# Altium schematic sheet SuperFin Baseboard pg7.SchDoc
size B; PageSetup: Record=PageOptions|CenterHorizontal=True|CenterVertical=True|PrintScale=1.09|XCorrection=1.00|YCorrection=1.00|PrintKind=0|BorderSize=5000000|LeftOffset=0|BottomOffset=0|Orientation=2|PaperLength=1000|PaperWidth=1000|Scale=100|PaperSource=7|PrintQuality=-4|MediaType=1|DitherType=10|PaperKind=Tabloid 11 x 17in|PrintScaleMode=1
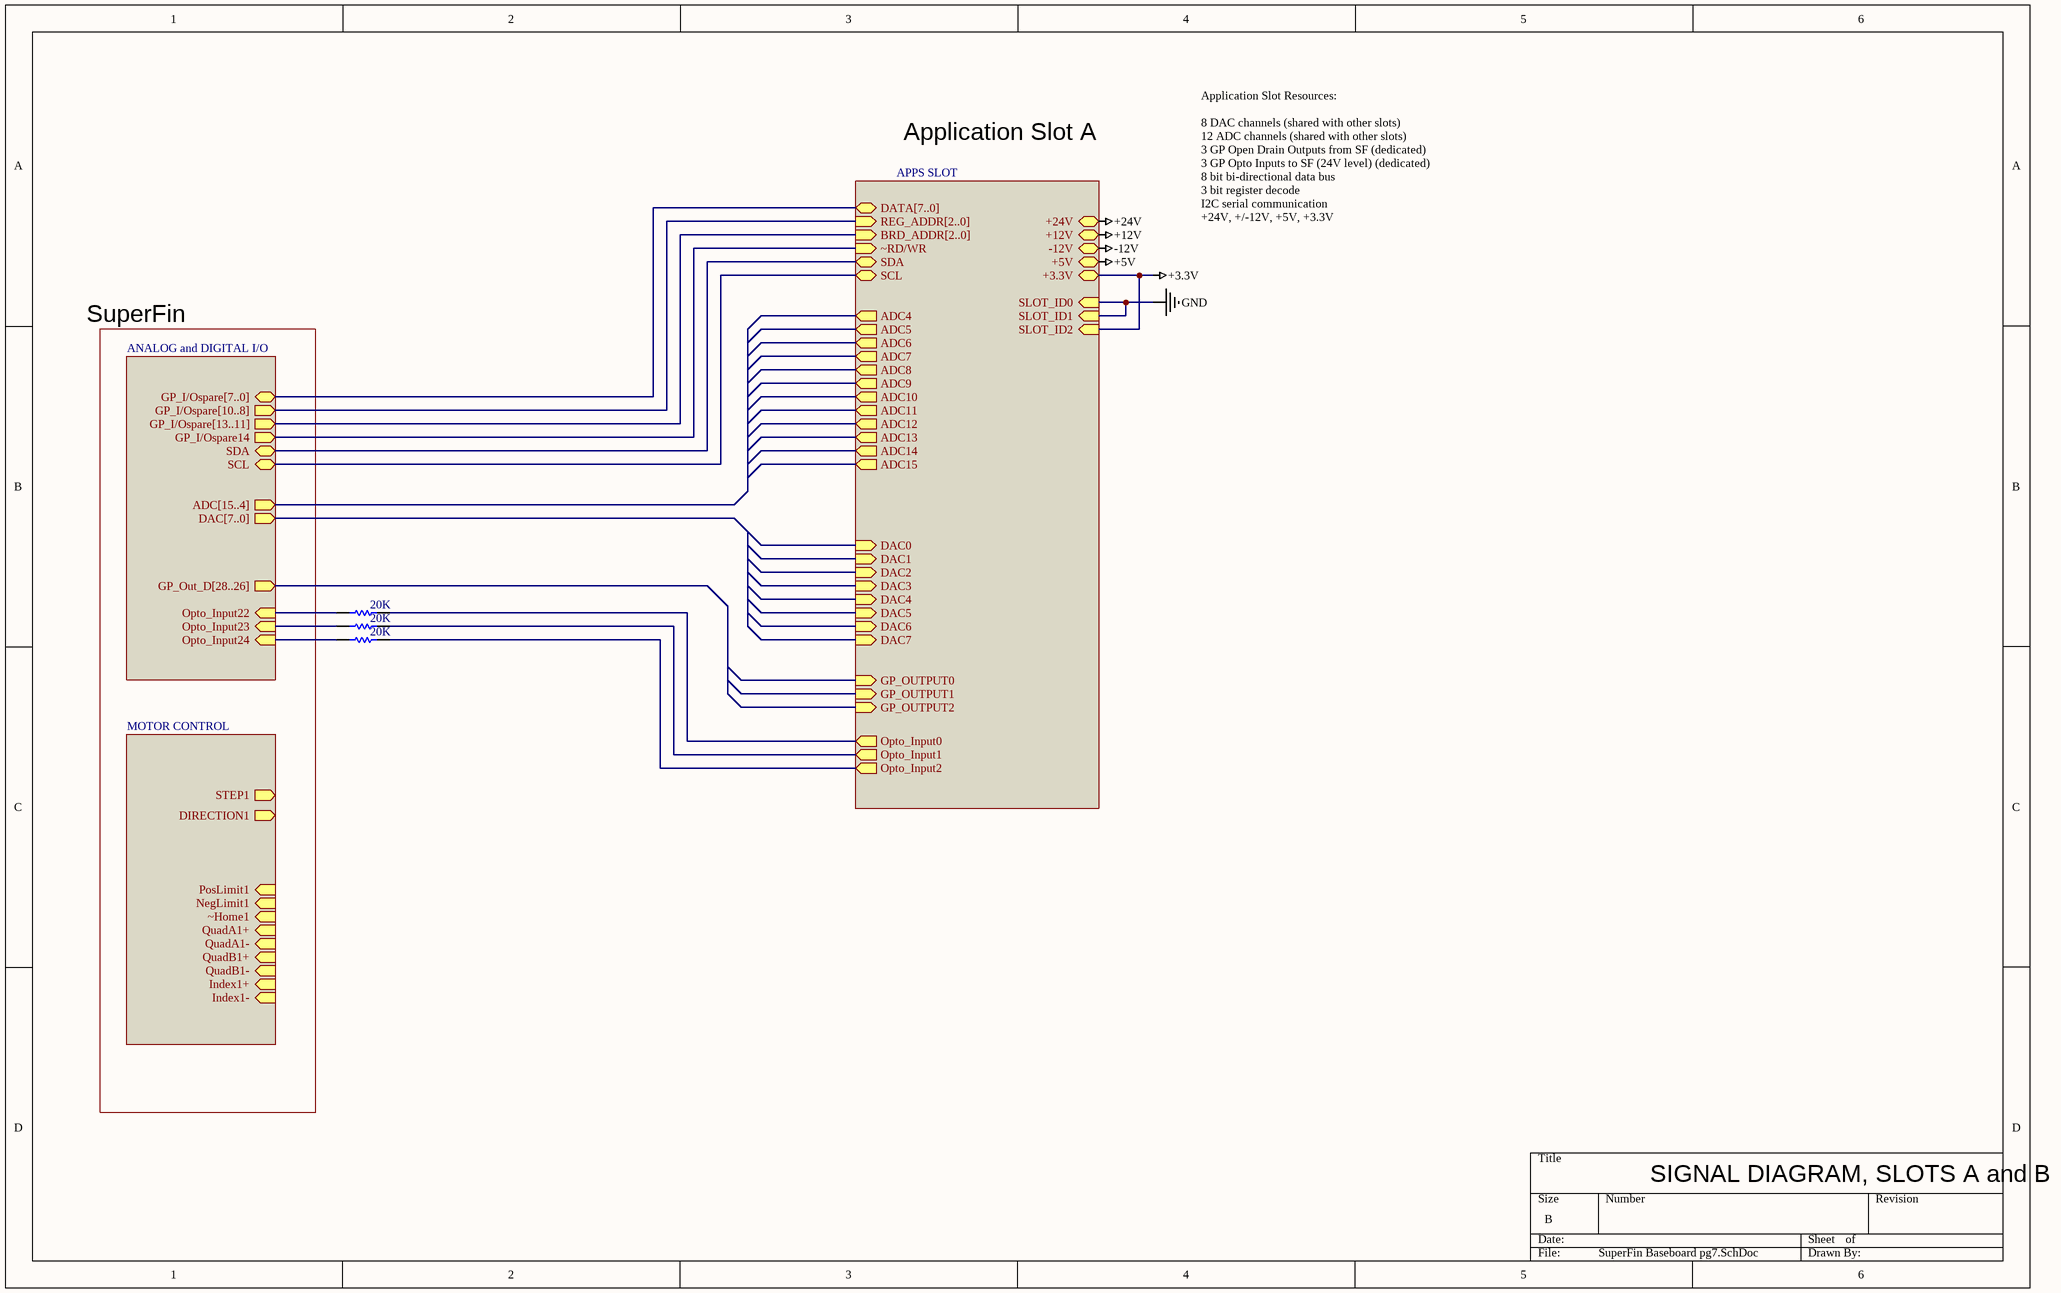
[diagram p0: SuperFin Baseboard pg7.SchDoc]

## Parts
R17  value 20K  [SMD_0805]  (hidden comment: Res 0805)
R18  value 20K  [SMD_0805]  (hidden comment: Res 0805)
R19  value 20K  [SMD_0805]  (hidden comment: Res 0805)

## Sub-sheets
? = ANALOG and DIGITAL I/O: GP_Out_D[28..26] (out), DAC[7..0] (out), Opto_Input22 (in), ADC[15..4] (out), SDA (bidir), SCL (bidir), Opto_Input23 (in), Opto_Input24 (in), GP_I/Ospare[7..0] (bidir), GP_I/Ospare[10..8] (out), GP_I/Ospare[13..11] (out), GP_I/Ospare14 (out)
? = MOTOR CONTROL: STEP1 (out), DIRECTION1 (out), PosLimit1 (in), NegLimit1 (in), ~Home1 (in), QuadA1+ (in), QuadA1- (in), QuadB1+ (in), QuadB1- (in), Index1+ (in), Index1- (in)
? = APPS SLOT: DAC1 (in), DAC2 (in), DAC3 (in), DATA[7..0] (bidir), REG_ADDR[2..0] (in), BRD_ADDR[2..0] (in), +5V (bidir), +24V (bidir), +12V (bidir), -12V (bidir), +3.3V (bidir), SLOT_ID0 (in), SLOT_ID1 (in), SLOT_ID2 (in), SDA (bidir), SCL (bidir), ADC4 (out), ADC5 (out), ADC6 (out), ADC7 (out), ADC8 (out), ADC9 (out), ADC10 (out), ADC11 (out), ADC12 (out), ADC13 (out), ADC14 (out), ADC15 (out), DAC0 (in), DAC4 (in), DAC5 (in), DAC6 (in), DAC7 (in), GP_OUTPUT0 (in), GP_OUTPUT1 (in), GP_OUTPUT2 (in), Opto_Input0 (out), Opto_Input1 (out), Opto_Input2 (out), ~RD/WR (in)

## Nets
+3.3V: sheet /+3.3V, sheet /SLOT_ID2
+5V: sheet /+5V
+12V: sheet /+12V
+24V: sheet /+24V
-12V: sheet /-12V
GND: sheet /SLOT_ID0, sheet /SLOT_ID1
NetR17_1: R17.1 ; sheet /Opto_Input22
NetR17_2: R17.2 ; sheet /Opto_Input0
NetR18_1: R18.1 ; sheet /Opto_Input23
NetR18_2: R18.2 ; sheet /Opto_Input1
NetR19_1: R19.1 ; sheet /Opto_Input24
NetR19_2: R19.2 ; sheet /Opto_Input2
(unnamed): sheet /SDA, sheet /SDA
(unnamed): sheet /SCL, sheet /SCL
(unnamed): sheet /GP_I/Ospare14, sheet /~RD/WR

## Buses and harness runs
bus sheet /BRD_ADDR[2..0] = sheet /GP_I/Ospare[13..11]
bus sheet /DATA[7..0] = sheet /GP_I/Ospare[7..0]
bus sheet /GP_I/Ospare[10..8] = sheet /REG_ADDR[2..0]

## Notes on the sheet
- Application Slot A
- Application Slot Resources:
  8 DAC channels (shared with other slots)
  12 ADC channels (shared with other slots)
  3 GP Open Drain Outputs from SF (dedicated)
  3 GP Opto Inputs to SF (24V level) (dedicated)
  8 bit bi-directional data bus
  3 bit register decode
  I2C serial communication
  +24V, +/-12V, +5V, +3.3V
- SuperFin
- SIGNAL DIAGRAM, SLOTS A and B

## Library data of the parts
R17-R19 = Res SMD: Resistor 0805; Manufacturer: Vishay/Dale; Manuf p/n: CRCW080520KFKEA; Vendor: DIGIKEY; Vendor p/n: 541-20KCCT-ND; Vendor Mult.: 10; COST: 0.09